# Altium schematic sheet WiFi_BT.SchDoc: WiFi and Bluetooth
size B; Revision: B01; SheetNumber: 5; SheetTotal: 5; ProjectCodeName: HiFive1; ProjectName: Cinque
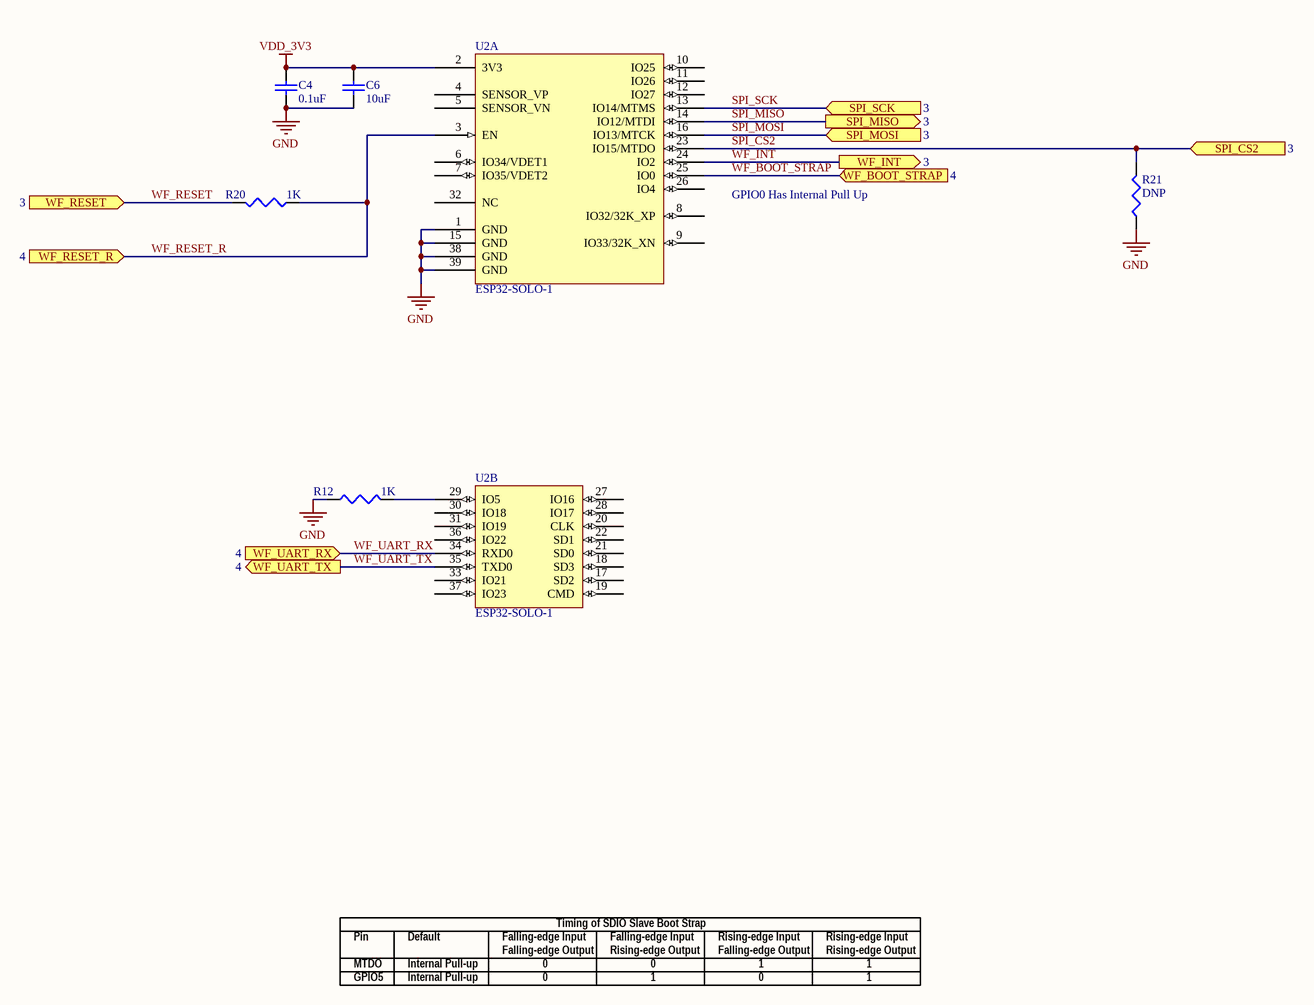
[diagram p0: WiFi_BT.SchDoc]

## Parts
C4  0.1uF  [C0402]
C6  10uF  [C0603]
R12  1K  [R0402]
R20  1K  [R0402]
R21  DNP  [R0402]  (no BOM)
U2  ESP32-SOLO-1  [ESP-WROOM-32]  (parts A,B of 2)

## Ports
SPI_CS2 (in, see 3), SPI_MISO (out, see 3), SPI_MOSI (in, see 3), SPI_SCK (in, see 3), WF_BOOT_STRAP (in, see 4), WF_INT (out, see 3), WF_RESET (in, see 3), WF_RESET_R (in, see 4), WF_UART_RX (in, see 4), WF_UART_TX (out, see 4)

## Nets
GND: C4.1 C6.2 R12.1 R21.1 U2.1(GND) U2.15(GND) U2.38(GND) U2.39(GND)
VDD_3V3: C4.2 C6.1 U2.2(3V3)
SPI_CS2: R21.2 U2.23(IO15/MTDO) ; port SPI_CS2
SPI_MISO: U2.14(IO12/MTDI) ; port SPI_MISO
SPI_MOSI: U2.16(IO13/MTCK) ; port SPI_MOSI
SPI_SCK: U2.13(IO14/MTMS) ; port SPI_SCK
WF_BOOT_STRAP: U2.25(IO0) ; port WF_BOOT_STRAP
WF_INT: U2.24(IO2) ; port WF_INT
WF_RESET: R20.2 ; port WF_RESET
WF_RESET_R: R20.1 U2.3(EN) ; port WF_RESET_R
WF_UART_RX: U2.34(RXD0) ; port WF_UART_RX
WF_UART_TX: U2.35(TXD0) ; port WF_UART_TX
NetR12_2: R12.2 U2.29(IO5)

Not connected (* = marked no-connect by the designer): U2 4(SENSOR_VP) 5(SENSOR_VN) 6(IO34/VDET1) 7(IO35/VDET2) 8(IO32/32K_XP) 9(IO33/32K_XN) 10(IO25) 11(IO26) 12(IO27) 17(SD2) 18(SD3) 19(CMD) 20(CLK) 21(SD0) 22(SD1) 26(IO4) 27(IO16) 28(IO17) 30(IO18) 31(IO19) 32(NC) 33(IO21) 36(IO22) 37(IO23)

## Notes on the sheet
- GPIO0 Has Internal Pull Up
- Timing of SDIO Slave Boot Strap
- Pin
- MTDO
- GPIO5
- Default
- Internal Pull-up
- Falling-edge Input
- Falling-edge Output
- 0
- Rising-edge Output
- 1
- Rising-edge Input
- Title
- Size:
- Date:
- B
- Proj:
- Revision:
- Sheet
- of
- File:

## Library data of the parts
C4 = C0100004: 0.10µF 16V Ceramic Capacitor X7R 0402; Manufacturer: Samsung Electro-Mechanics; Manufacturer PN: CL05B104KO5NFNC; Tolerance: ±10%; Part Number: C0100004; Value: 0.1uF; Type: X7R; Voltage Rating: 16V; Operating Temperature: -55°C ~ 125°C
C6 = C0100033: CAP CER 10UF 10V X5R 0603; Manufacturer: Murata Electronics; Manufacturer PN: GRM188R61A106KE69J; Tolerance: ±10%; Part Number: C0100033; Value: 10uF; Type: X5R; Voltage Rating: 10V; Operating Temperature: -55°C ~ 85°C
R12 R20 R21 = R0000019: RES SMD 1K OHM 1% 1/16W 0402; Manufacturer: Yageo; Manufacturer PN: RC0402FR-071KL; Power Rating: 0.063W; Part Number: R0000019; Value: 1K; Tolerance: ±1%; Type: Thick Film; Temperature Range: -55°C ~ 155°C
U2 = U0000061: WiFi 802.11n + BT4.2 Chipset Module Single Core with PCB Antenna 18mmx25.5mm; Manufacturer: Espressif Systems; Part Number: U0000061; Value: ESP32-SOLO-1; Manufacturer PN: ESP32-SOLO-1; Temperature Range: -40°C ~ 85°C